# EAGLE design d709-vs1053-synth (EAGLE 7.6.0)
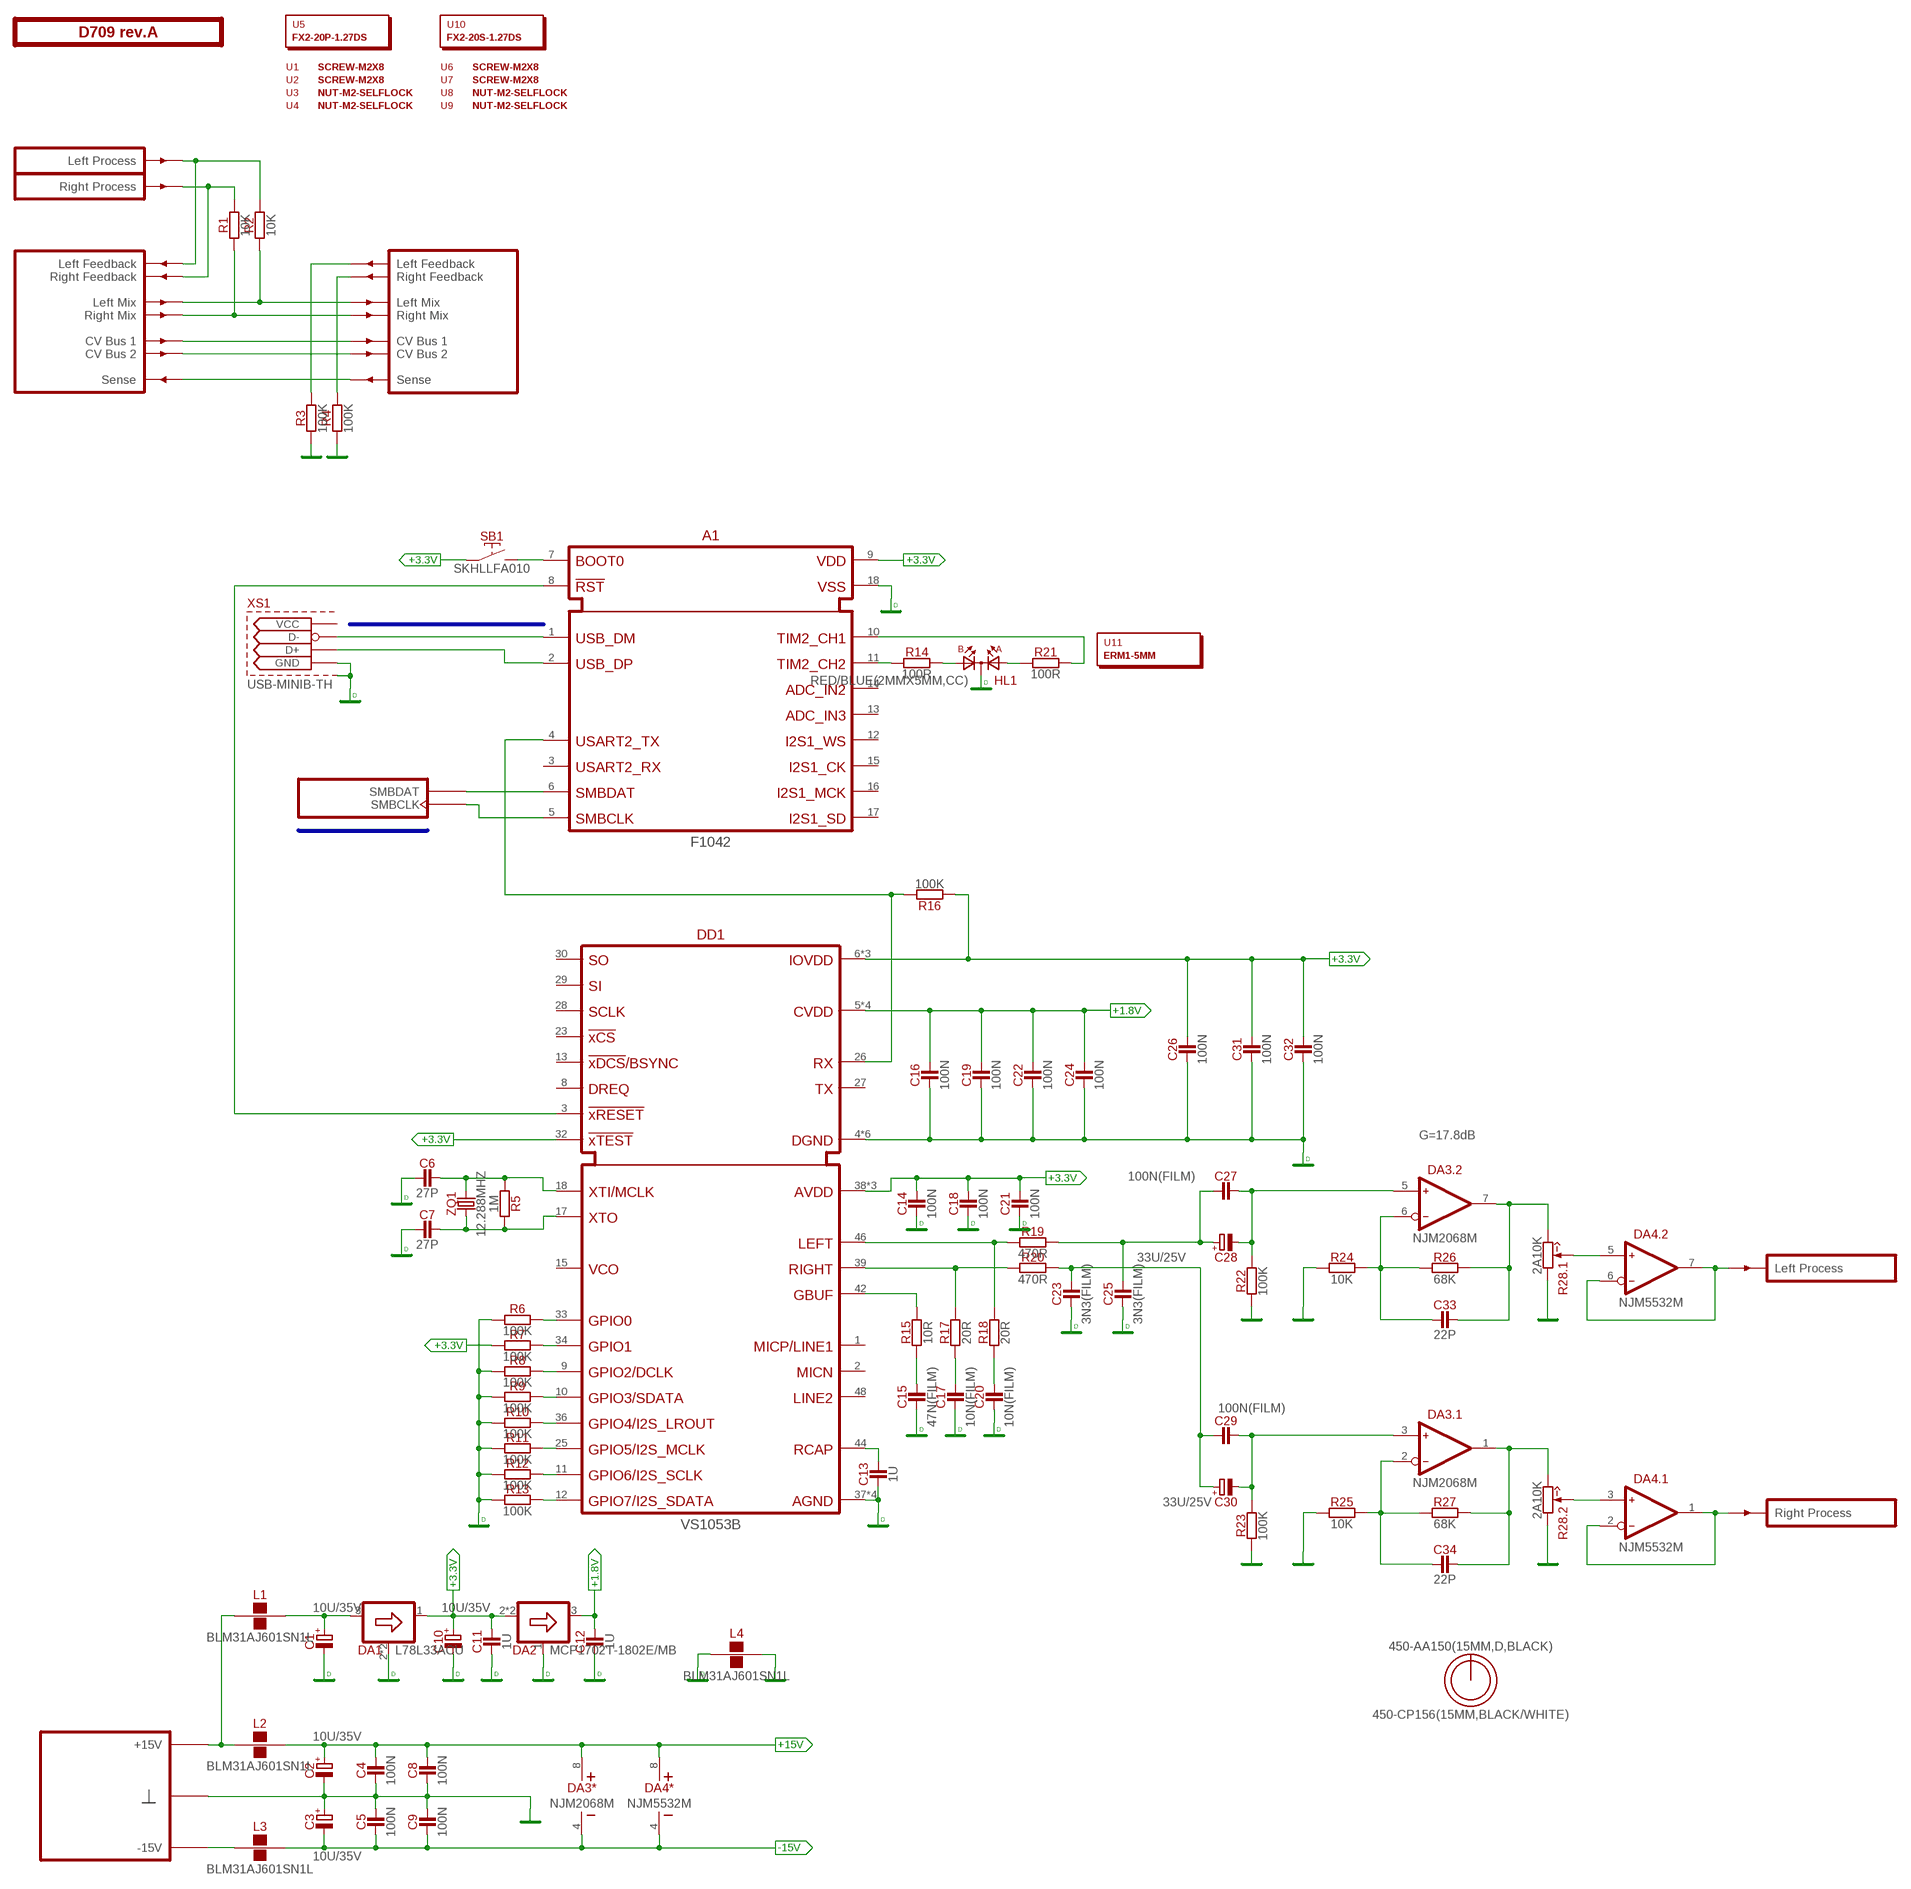
[diagram p0: schematic, sheet 1]

## Parts
A1  F1042  [F-DIP18]
C1  10U/35V  [E2-5]
C2  10U/35V  [E2-5]
C3  10U/35V  [E2-5]
C4  100N  [C-0805]
C5  100N  [C-0805]
C6  27P  [C-0805]
C7  27P  [C-0805]
C8  100N  [C-0805]
C9  100N  [C-0805]
C10  10U/35V  [E2-5]
C11  1U  [C-0805]
C12  1U  [C-0805]
C13  1U  [C-0805]
C14  100N  [C-0805]
C15  47N(FILM)  [C050-025X075]
C16  100N  [C-0805]
C17  10N(FILM)  [C050-025X075]
C18  100N  [C-0805]
C19  100N  [C-0805]
C20  10N(FILM)  [C050-025X075]
C21  100N  [C-0805]
C22  100N  [C-0805]
C23  3N3(FILM)  [C050-025X075]
C24  100N  [C-0805]
C25  3N3(FILM)  [C050-025X075]
C26  100N  [C-0805]
C27  100N(FILM)  [C050-025X075]
C28  33U/25V  [E2,5-7]
C29  100N(FILM)  [C050-025X075]
C30  33U/25V  [E2,5-7]
C31  100N  [C-0805]
C32  100N  [C-0805]
C33  22P  [C-0805]
C34  22P  [C-0805]
DA1  L78L33ACU  [SOT89]
DA2  MCP1702T-1802E/MB  [SOT89]
DA3  NJM2068M  [SO-8]
DA4  NJM5532M  [SO-8]
DD1  VS1053B  [LQFP48-7X7]
HL1  RED/BLUE(2MMX5MM,CC)  [LED2X5-3PIN]
L1  BLM31AJ601SN1L  [1206]
L2  BLM31AJ601SN1L  [1206]
L3  BLM31AJ601SN1L  [1206]
L4  BLM31AJ601SN1L  [1206]
O1  450-AA150(15MM,D,BLACK)  [EMPTY]
O2  450-CP156(15MM,BLACK/WHITE)  [EMPTY]
PCB1  D709 rev.A  ST2-BOARD-50  [ST2-BOARD-50]
R1  10K  [R-0805]
R2  10K  [R-0805]
R3  100K  [R-0805]
R4  100K  [R-0805]
R5  1M  [R-0805]
R6  100K  [R-0805]
R7  100K  [R-0805]
R8  100K  [R-0805]
R9  100K  [R-0805]
R10  100K  [R-0805]
R11  100K  [R-0805]
R12  100K  [R-0805]
R13  100K  [R-0805]
R14  100R  [R-0805]
R15  10R  [R-0805]
R16  100K  [R-0805]
R17  20R  [R-0805]
R18  20R  [R-0805]
R19  470R  [R-0805]
R20  470R  [R-0805]
R21  100R  [R-0805]
R22  100K  [R-0805]
R23  100K  [R-0805]
R24  10K  [R-0805]
R25  10K  [R-0805]
R26  68K  [R-0805]
R27  68K  [R-0805]
R28  2A10K  [RV11-DUAL]
SB1  SKHLLFA010  [SKHLLFA010]
U1  SCREW-M2X8  [EMPTY]
U2  SCREW-M2X8  [EMPTY]
U3  NUT-M2-SELFLOCK  [EMPTY]
U4  NUT-M2-SELFLOCK  [EMPTY]
U5  FX2-20P-1.27DS  [EMPTY]
U6  SCREW-M2X8  [EMPTY]
U7  SCREW-M2X8  [EMPTY]
U8  NUT-M2-SELFLOCK  [EMPTY]
U9  NUT-M2-SELFLOCK  [EMPTY]
U10  FX2-20S-1.27DS  [EMPTY]
U11  ERM1-5MM  [EMPTY]
XS1  USB-MINIB-TH  [USB-MB-H]
ZQ1  12.288MHZ  [3225]

## Nets
+1.8V: C12.2 C16.2 C19.2 C22.2 C24.2 DA2.3(OUT) DD1.5(CVDD) DD1.7(CVDD) DD1.24(CVDD) DD1.31(CVDD)
+3.3V: A1.9(VDD) C10.+ C11.2 C14.2 C18.2 C21.2 C26.2 C31.2 C32.2 DA1.1(OUT) DA2.2(IN) DA2.2@1(IN) DD1.6(IOVDD) DD1.14(IOVDD) DD1.19(IOVDD) DD1.32(!XTEST) DD1.38(AVDD) DD1.43(AVDD) DD1.45(AVDD) R7.1 R16.1 SB1.1
+15V: C2.+ C4.2 C8.2 DA3.8(*:V+) DA4.8(*:V+) L2.2
-15V: C3.- C5.1 C9.1 DA3.4(*:V-) DA4.4(*:V-) L3.2
DGND: A1.18(VSS) C1.- C6.1 C7.1 C10.- C11.1 C12.1 C13.1 C14.1 C15.1 C16.1 C17.1 C18.1 C19.1 C20.1 C21.1 C22.1 C23.1 C24.1 C25.1 C26.1 C31.1 C32.1 DA1.2(GND) DA1.2@1(GND) DA2.1(GND) DD1.4(DGND) DD1.16(DGND) DD1.20(DGND) DD1.21(DGND) DD1.22(DGND) DD1.35(DGND) DD1.37(AGND) DD1.40(AGND) DD1.41(AGND) DD1.47(AGND) HL1.K L4.1 R6.1 R8.1 R9.1 R10.1 R11.1 R12.1 R13.1 XS1.GND XS1.P$1(S1) XS1.P$2(S1) XS1.P$6(S1) XS1.P$7(S1)
GND: C2.- C3.+ C4.1 C5.2 C8.1 C9.2 L4.2 PCB1.B4'(GND) PCB1.B4(GND) PCB1.B5'(GND) PCB1.B5(GND) PCB1.B6'(GND) PCB1.B6(GND) PCB1.B7'(GND) PCB1.B7(GND) PCB1.B8'(GND) PCB1.B8(GND) R3.1 R4.1 R22.1 R23.1 R24.1 R25.1 R28.1'(.2:CCW) R28.1(.1:CCW)
LMIX: PCB1.ALMIX'(LMIX') PCB1.ALMIX(LMIX) R2.1
N$1 [power]: L1.1 L2.1 PCB1.A+15'(P+15V) PCB1.A+15(P+15V) PCB1.B+15'(P+15V) PCB1.B+15(P+15V)
N$2: PCB1.ARFBK'(RFBK') R4.2
N$3: A1.7(BOOT0) SB1.2
N$4: PCB1.ALFBK'(LFBK') R3.2
N$5 [power]: L3.1 PCB1.A-15'(P-15V) PCB1.A-15(P-15V) PCB1.B-15'(P-15V) PCB1.B-15(P-15V)
N$7: C25.2 C27.1 C28.+ R19.2
N$9: C29.2 C30.- DA3.3(.1:IN+) R23.2
N$10: C27.2 C28.- DA3.5(.2:IN+) R22.2
N$11: C34.2 DA3.1(.1:OUT) R27.2 R28.3'(.2:CW)
N$12: C33.2 DA3.7(.2:OUT) R26.2 R28.3(.1:CW)
N$13: C33.1 DA3.6(.2:IN-) R24.2 R26.1
N$14: C34.1 DA3.2(.1:IN-) R25.2 R27.1
N$16: PCB1.BSENSE'(SENSE') PCB1.BSENSE(SENSE)
N$17: C7.2 DD1.17(XTO) R5.2 ZQ1.1
N$18: DA4.6(.2:IN-) DA4.7(.2:OUT) PCB1.BOUTL'(OUTL)
N$21: DA4.1(.1:OUT) DA4.2(.1:IN-) PCB1.BOUTR'(OUTR)
N$23: DA4.5(.2:IN+) R28.2(.1:W)
N$25: DA4.3(.1:IN+) R28.2'(.2:W)
N$29: C1.+ DA1.3(IN) L1.2
N$31: C6.2 DD1.18(XTI/MCLK) R5.1 ZQ1.3
N$36: C23.2 C29.1 C30.+ R20.2
N$39: PCB1.ARFBK(RFBK) PCB1.BINR(INR) R1.2
N$40: PCB1.ALFBK(LFBK) PCB1.BINL(INL) R2.2
N$41: PCB1.ACV1'(CV1') PCB1.ACV1(CV1)
N$42: PCB1.ACV2'(CV2') PCB1.ACV2(CV2)
N$44: A1.8(!RST) DD1.3(!XRESET)
N$45: DD1.12(GPIO7/I2S_SDATA) R13.2
N$46: DD1.11(GPIO6/I2S_SCLK) R12.2
N$47: DD1.25(GPIO5/I2S_MCLK) R11.2
N$48: A1.4(USART2_TX) DD1.26(RX) R16.2
N$49: DD1.36(GPIO4/I2S_LROUT) R10.2
N$50: DD1.10(GPIO3/SDATA) R9.2
N$51: DD1.9(GPIO2/DCLK) R8.2
N$52: DD1.34(GPIO1) R7.2
N$53: DD1.33(GPIO0) R6.2
N$54: C13.2 DD1.44(RCAP)
N$55: A1.11(TIM2_CH2) R14.1
N$56: C15.2 R15.1
N$57: HL1.A2 R14.2
N$58: DD1.42(GBUF) R15.2
N$59: DD1.39(RIGHT) R17.2 R20.1
N$60: C17.2 R17.1
N$61: DD1.46(LEFT) R18.2 R19.1
N$62: C20.2 R18.1
N$65: HL1.A1 R21.1
N$66: A1.10(TIM2_CH1) R21.2
RMIX: PCB1.ARMIX'(RMIX') PCB1.ARMIX(RMIX) R1.1
SMBCLK: A1.5(SMBCLK) PCB1.ASMBCLK'(SMBCLK) PCB1.ASMBCLK(SMBCLK)
SMBDAT: A1.6(SBMDAT) PCB1.ASMBDAT'(SMBDAT) PCB1.ASMBDAT(SMBDAT)
USB_N: A1.1(USB_DM) XS1.D-
USB_P: A1.2(USB_DP) XS1.D+
Unconnected: A1.3(USART2_RX) A1.12(I2S1_WS) A1.13(ADC_IN3) A1.14(ADC_IN2) A1.15(I2S1_CK) A1.16(I2S1_MCK) A1.17(I2S1_SD) DD1.1(MICP/LINE1) DD1.2(MICN) DD1.8(DREQ) DD1.13(!XDCS/BSYNC) DD1.15(VCO) DD1.23(!XCS) DD1.27(TX) DD1.28(SCLK) DD1.29(SI) DD1.30(SO) DD1.48(LINE2) XS1.VBUS(VCC)

## Buses
SMBDAT,SMBCLK
USB_N,USB_P

## Notes on the sheet
- G=17.8dB

## Library data of the parts
A1 = module-footprints:F1042
C1-C3 C10 = capacitors-electrolytic:?; MOUSER: 647-USW1V100MDD
C4 C5 C8 C9 C14 C16 C18 C19 C21 C22 C24 C26 C31 C32 = capacitors:?; MOUSER: 77-VJ0805V104MXBPBC
C6 C7 = capacitors:?; MOUSER: 77-VJ0805A270GXACBC
C11-C13 = capacitors:?; MOUSER: 77-VJ0805V105ZXXTBC
C15 = capacitors:?; MOUSER: 871-B32529C1473J
C17 C20 = capacitors:?; MOUSER: 80-F622JF103J100C
C23 C25 = capacitors:?; MOUSER: 505-FKS23300/100/10
C27 C29 = capacitors:?; MOUSER: 505-MKS2.1/63/5
C28 C30 = capacitors-electrolytic:?
C33 C34 = capacitors:?; MOUSER: 77-VJ0805A220GXACBC
DA1 = regulators-linear:?; MOUSER: 511-L78L33ACU
DA2 = regulators-linear:?; MOUSER: 579-MCP1702T1802E/MB
DA3 = ic-jrc:NJM2068; MOUSER: 513-NJM2068M
DA4 = ic-jrc:NJM5532; MOUSER: 513-NJM5532M
DD1 = ic-vlsi:VS1053B
HL1 = optoelectronics:?(2MMX5MM,CC)
L1-L4 = inductors:BLM31AJ601SN1L; MOUSER: 81-BLM31AJ601SN1L
O1 = hardware:450-AA?; MOUSER: 450-AA150
O2 = hardware:450-C?; MOUSER: 450-CP156
PCB1 = module-footprints:ST2-BOARD-?
R1 R2 R24 R25 = resistors:?; MOUSER: 660-RK73H2ATTD1002F
R3 R4 R6-R13 R16 R22 R23 = resistors:?; MOUSER: 660-RK73H2ATTD1003F
R5 = resistors:?; MOUSER: 660-RK73H2ATTD1004F
R14 R21 = resistors:?; MOUSER: 660-RK73H2ATTD1000F
R15 = resistors:?; MOUSER: 660-RK73H2ATTD10R0F
R17 R18 = resistors:?; MOUSER: 660-RK73H2ATTD20R0F
R19 R20 = resistors:?; MOUSER: 660-RK73H2ATTD4700F
R26 R27 = resistors:?; MOUSER: 660-RK73H2ATTD6802F
R28 = potentiometers:2**?; MOUSER: 688-RK12L12C0A0E
SB1 = switches:SKHLLFA010; MOUSER: 688-SKHLLF
U1-U4 U6-U9 = hardware:*?
U5 = hardware:?; MOUSER: 798-FX2-20P-1.27DS71
U10 = hardware:?; MOUSER: 798-FX2-20S-1.27DS71
U11 = hardware:?
XS1 = connectors:USB-MINIB-TH
ZQ1 = frequency:?; MOUSER: 581-CX3225GB1228PHPC

## Board
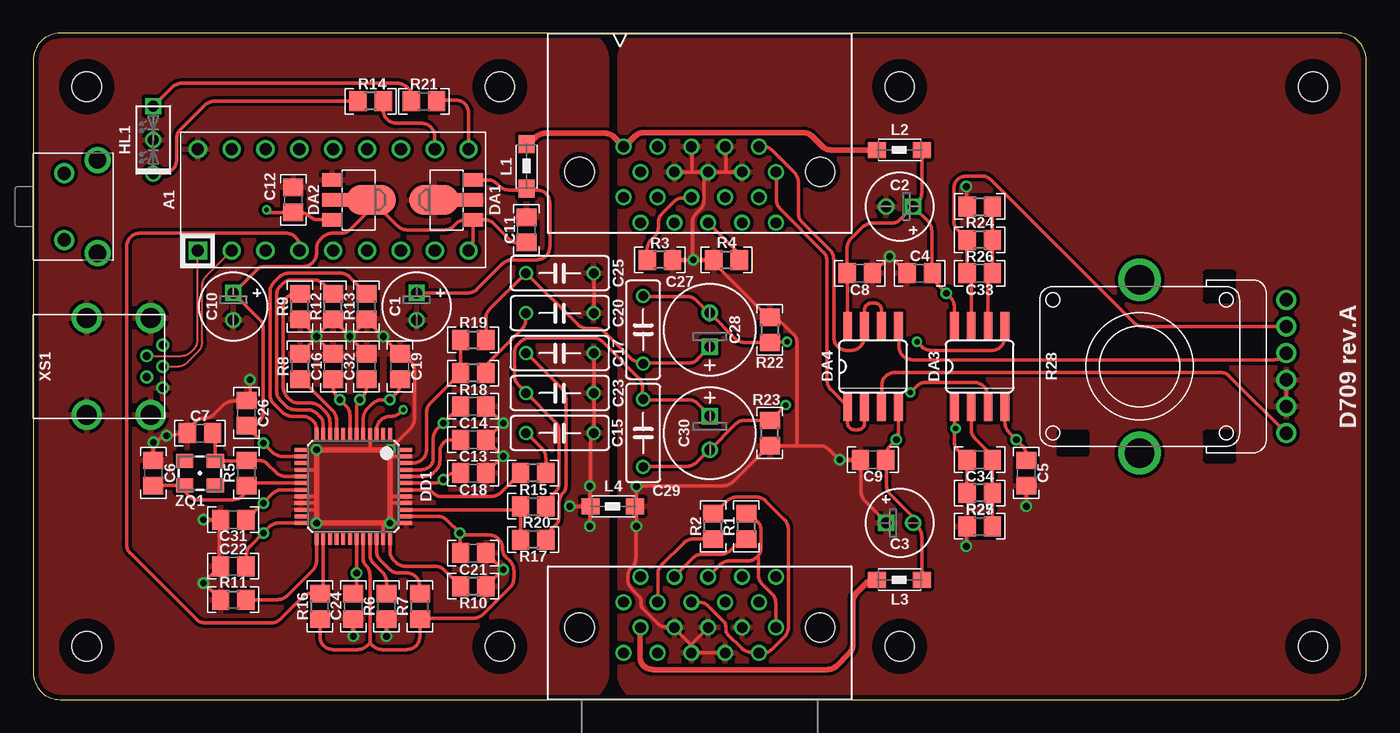
[diagram p1: board, top side]
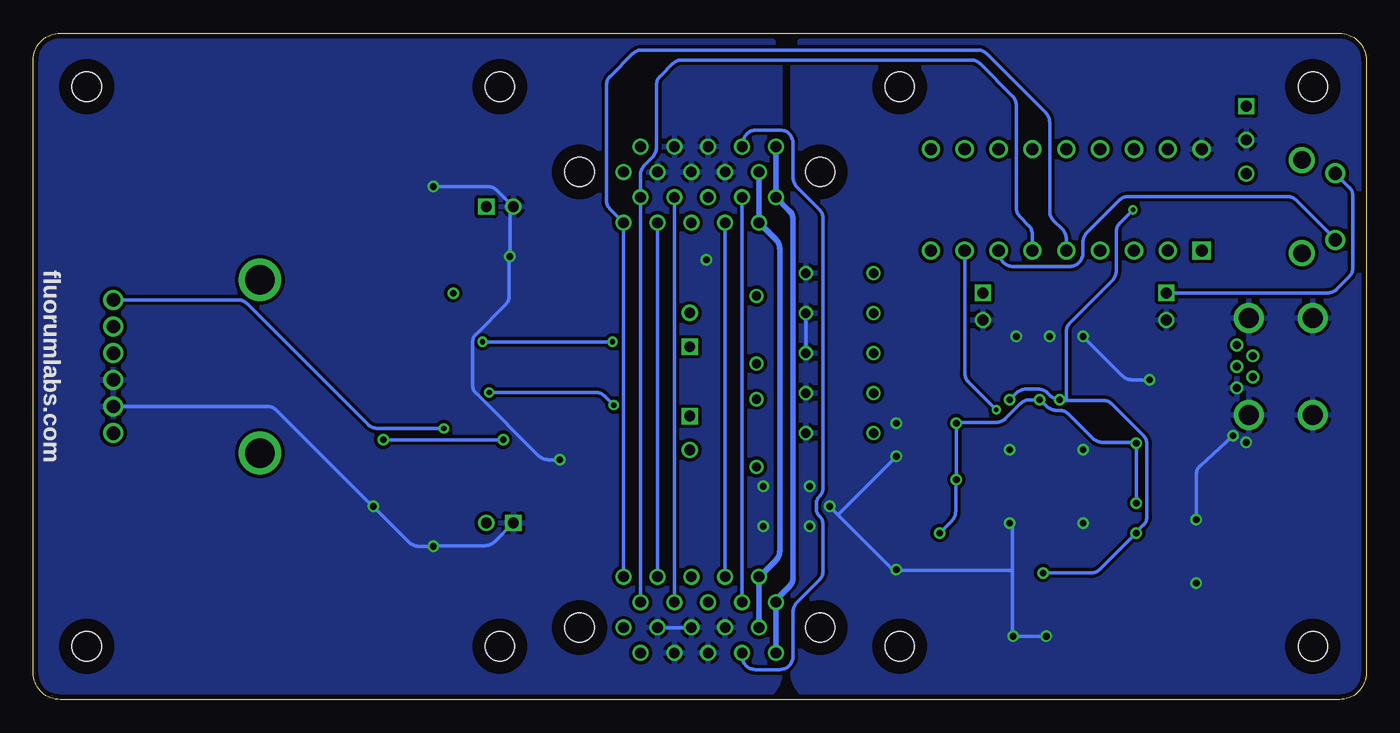
[diagram p2: board, bottom side, seen from below]

Size 100 x 50 mm. Coordinates in mm from the lower left corner, seen from the top.
Outline: 0,48 0,2 arc90 2,0 98,0 arc90 100,2 100,48 arc90 98,50 2,50 arc90 0,48
Copper layers (1*16): Top 0.0356mm / dielectric 1.5011mm / Bottom 0.0356mm
Design rules "sonictrain": minimum track width 6mil, minimum drill 13mil, track to track 8mil, track to pad 8mil, pad to pad 6mil, via to via 6mil, smd to smd 6mil, copper to edge 15mil, drill to drill 6mil, minimum pad ring 7mil, minimum via ring 7mil, stop-mask expansion 3mil, vias tented up to drill 25mil, thermal gap 10mil

### Footprints (pad centres in the part's own frame; a part is rotated, then mirrored left to right if it is on the bottom)
F-DIP18 = drill 0.914 square: 1 -10.16,-3.81 | drill 0.914: 2 -7.62,-3.81; 3 -5.08,-3.81; 4 -2.54,-3.81; 5 0,-3.81; 6 2.54,-3.81; 7 5.08,-3.81; 8 7.62,-3.81; 9 10.16,-3.81; 10 10.16,3.81; 11 7.62,3.81; 12 5.08,3.81; 13 2.54,3.81; 14 0,3.81; 15 -2.54,3.81; 16 -5.08,3.81; 17 -7.62,3.81; 18 -10.16,3.81
E2-5 = drill 0.813 square: + -1.016,0 | drill 0.813: - 1.016,0
C-0805 = smd 1.3 x 1.5: 1 -0.95,0; 2 0.95,0
C050-025X075 = drill 0.7: 1 -2.54,0; 2 2.54,0
E2,5-7 = drill 0.813 square: + -1.27,0 | drill 0.813: - 1.27,0
SOT89 = smd 1 x 1.5: 1 -1.499,-1.981; 3 1.499,-1.981 | smd 1 x 2: 2 0,-1.727 | smd 2.2 x 3.7: 2@1 0,0.94
SO-8 = smd 0.66 x 2.032: 1 -1.905,-3.073; 2 -0.635,-3.073; 3 0.635,-3.073; 4 1.905,-3.073; 5 1.905,3.073; 6 0.635,3.073; 7 -0.635,3.073; 8 -1.905,3.073
LQFP48-7X7 = smd 0.9 x 0.3: 1 -3.95,2.75; 2 -3.95,2.25; 3 -3.95,1.75; 4 -3.95,1.25; 5 -3.95,0.75; 6 -3.95,0.25; 7 -3.95,-0.25; 8 -3.95,-0.75; 9 -3.95,-1.25; 10 -3.95,-1.75; 11 -3.95,-2.25; 12 -3.95,-2.75; 25 3.95,-2.75; 26 3.95,-2.25; 27 3.95,-1.75; 28 3.95,-1.25; 29 3.95,-0.75; 30 3.95,-0.25; 31 3.95,0.25; 32 3.95,0.75; 33 3.95,1.25; 34 3.95,1.75; 35 3.95,2.25; 36 3.95,2.75 | smd 0.3 x 0.9: 13 -2.75,-3.95; 14 -2.25,-3.95; 15 -1.75,-3.95; 16 -1.25,-3.95; 17 -0.75,-3.95; 18 -0.25,-3.95; 19 0.25,-3.95; 20 0.75,-3.95; 21 1.25,-3.95; 22 1.75,-3.95; 23 2.25,-3.95; 24 2.75,-3.95; 37 2.75,3.95; 38 2.25,3.95; 39 1.75,3.95; 40 1.25,3.95; 41 0.75,3.95; 42 0.25,3.95; 43 -0.25,3.95; 44 -0.75,3.95; 45 -1.25,3.95; 46 -1.75,3.95; 47 -2.25,3.95; 48 -2.75,3.95
LED2X5-3PIN = drill 0.813 square: A1 -2.54,0 | drill 0.813: A2 2.54,0; K 0,0
1206 = smd 1.35 x 1.2: 1 -1.7,0; 2 1.65,0
ST2-BOARD-50 = drill 0.8: A+15 44.285,7.31; A+15' 44.285,37.69; A-15 45.555,9.215; A-15' 45.555,35.785; ACV1 51.905,7.31; ACV1' 51.905,37.69; ACV2 53.175,9.215; ACV2' 53.175,35.785; ALFBK 49.365,7.31; ALFBK' 49.365,37.69; ALMIX 46.825,7.31; ALMIX' 46.825,37.69; ARFBK 50.635,9.215; ARFBK' 50.635,35.785; ARMIX 48.095,9.215; ARMIX' 48.095,35.785; ASMBCLK 55.715,9.215; ASMBCLK' 55.715,35.785; ASMBDAT 54.445,7.31; ASMBDAT' 54.445,37.69; B4 48.095,5.405; B4' 48.095,39.595; B5 49.365,3.5; B5' 49.365,41.5; B6 50.635,5.405; B6' 50.635,39.595; B7 51.905,3.5; B7' 51.905,41.5; B8 53.175,5.405; B8' 53.175,39.595; B+15 44.285,3.5; B+15' 44.285,41.5; B-15 45.555,5.405; B-15' 45.555,39.595; BINL 54.445,3.5; BINR 55.715,5.405; BOUTL' 54.445,41.5; BOUTR' 55.715,39.595; BSENSE 46.825,3.5; BSENSE' 46.825,41.5 | hole 2.2: 4,4; 4,46; 96,4; 96,46; 35,46; 65,46; 65,4; 35,4; 59.025,5.405; 40.975,5.405; 40.975,39.595; 59.025,39.595
R-0805 = smd 1.3 x 1.5: 1 -0.95,0; 2 0.95,0
RV11-DUAL = drill 1: 1 -1,-11; 1' -3,-11; 2 1,-11; 2' -5,-11; 3 3,-11; 3' 5,-11 | drill 2.2: S1 -6.5,0; S2 6.5,0
SKHLLFA010 = drill 1: 1 -2.5,2.32; 2 2.5,2.32 | drill 1.3: S1 -3.5,4.82; S2 3.5,4.82
USB-MB-H = drill 0.6: D+ 9.7,0; D- 8.5,0.8; GND 9.7,-1.6; ID 8.5,-0.8; VBUS 9.7,1.6 | drill 1.5: P$1 8.8,3.65; P$2 8.8,-3.65; P$6 4,-3.65; P$7 4,3.65
3225 = smd 1.3 x 1.05: 1 -1.15,-0.925; 2 1.15,-0.925; 3 1.15,0.925; 4 -1.15,0.925

### Placement (x,y rotation side)
A1  22.5,37.5 0 top
C1  28.75,29.5 270 top
C2  65,37 180 top
C3  65,13.25 0 top
C4  66.5,32 0 top
C5  74.5,17 270 top
C6  9,17 270 top
C7  12.5,20 0 top
C8  62,32 180 top
C9  63,18 180 top
C10  15,29.5 270 top
C11  37,35.25 270 top
C12  19.5,37.5 270 top
C13  33,19.5 180 top
C14  33,22 180 top
C15  39.5,20 180 top
C16  22.5,25 270 top
C17  39.5,26 180 top
C18  33,17 180 top
C19  27.5,25 270 top
C20  39.5,29 180 top
C21  33,11 180 top
C22  15,10 0 top
C23  39.5,23 180 top
C24  24,7 90 top
C25  39.5,32 180 top
C26  16,21.5 270 top
C27  45.75,27.75 90 top
C28  50.75,27.75 90 top
C29  45.75,20 270 top
C30  50.75,20 270 top
C31  15,13.5 0 top
C32  25,25 270 top
C33  71,32 180 top
C34  71,18 180 top
DA1  31,37.5 90 top
DA2  24.4,37.5 270 top
DA3  71,25 0 top
DA4  63,25 0 top
DD1  24,16 270 top
HL1  9,42 270 top
L1  37,40 270 top
L2  65,41.25 0 top
L3  65,9 0 top
L4  43.5,14.5 0 top
O1  84,-100 0 top  (outside the outline)
O2  87,-100 0 top  (outside the outline)
PCB1  0,0 0 top
R1  53.5,13 90 top
R2  51,13 90 top
R3  47,33 180 top
R4  52,33 0 top
R5  16,17 90 top
R6  26.5,7 90 top
R7  29,7 90 top
R8  20,25 270 top
R9  20,29.5 90 top
R10  33,8.5 180 top
R11  15,7.5 0 top
R12  22.5,29.5 90 top
R13  25,29.5 90 top
R14  25.3,44.9 180 top
R15  37.5,17 180 top
R16  21.5,7 90 top
R17  37.5,12 180 top
R18  33,24.5 180 top
R19  33,27 0 top
R20  37.5,14.5 0 top
R21  29.3,44.9 0 top
R22  55.25,27.75 270 top
R23  55.25,20 90 top
R24  71,37 0 top
R25  71,13 0 top
R26  71,34.5 180 top
R27  71,15.5 180 top
R28  2*A10K  [RV11-DUAL]  83,25 90 top
SB1  0,37 270 top
U1  -8,-104.25 0 top  (outside the outline)
U2  -9,-105.5 0 top  (outside the outline)
U3  -12,-109.25 0 top  (outside the outline)
U4  -13,-110.5 0 top  (outside the outline)
U5  96,-100 0 top  (outside the outline)
U6  -10,-106.75 0 top  (outside the outline)
U7  -11,-108 0 top  (outside the outline)
U8  -14,-111.75 0 top  (outside the outline)
U9  -15,-113 0 top  (outside the outline)
U10  2,-103 0 top  (outside the outline)
U11  5,-103 0 top  (outside the outline)
XS1  0,25 0 top
ZQ1  12.5,17 180 top

### Tracks (layer width: path | path; a pad name or v marks a point on that pad's centre or on a via)
+1.8V  (via drill 0.33, 0.5)
  Top 0.254: C22.2 16,10.05 16,10.84 arc-45 16.29,11.54 v17.25,12.5 17.71,12.96 arc-45 18.41,13.25 DD1.24 | C24.2 24.25,8.2 v24.25,9.5 DD1.31 | DD1.7 23.75,21.34 arc45 23.46,22.04 v23,22.5 22.79,22.71 arc-45 22.5,23.41 C16.2 | DD1.5 24.75,21.09 arc-45 25.04,21.79 25.46,22.21 arc-45 26.16,22.5 v26.75,22.5 27.21,22.96 arc45 27.5,23.66 C19.2 | v17.5,36.75 17.7,36.55 C12.2 19.55,36.5 20.21,36.5 arc-45 20.71,36.29 arc45 21.41,36 DA2.3
  Bottom 0.254: v26.75,22.5 26.24,23.01 arc45 25.54,23.3 24.61,23.3 arc45 23.91,23.01 23.68,22.78 arc-45 v23,22.5 22.9,22.45 22.5,22.45 | v24.25,9.5 20.66,9.5 arc-45 19.96,9.79 v17.25,12.5 17.2,12.6 16.74,13.06 arc-45 16.45,13.76 16.45,19.14 arc-45 16.74,19.84 19.06,22.16 arc-45 19.76,22.45 22.5,22.45 | v17.5,36.75 18.46,35.79 arc-45 18.75,35.09 18.75,32.16 arc45 19.04,31.46 22.21,28.29 arc-45 22.5,27.59 22.5,22.45
+3.3V  (via drill 0.5)
  Top 0.254: DD1.38 30.34,13.75 arc-45 31.04,13.46 v32,12.5 | v32,12.5 32,11.05 C21.2 | DD1.45 29.09,17.25 arc45 29.79,17.54 arc45 30,18.04 30,19.59 arc-45 30.29,20.29 v30.75,20.75 32,22 C14.2 | DD1.32 24.75,10.54 arc45 24.96,10.04 arc-45 25.25,9.34 25.25,4.25 | 25.25,4.25 25.04,4.04 arc-45 24.34,3.75 22.5,3.75 arc-90 21.5,4.75 R16.1 | DD1.6 24.25,21.9 arc-45 v24.5,22.5 24.71,22.71 arc45 25,23.41 C32.2 | DD1.43 30.15,16.25 arc45 v30.75,16.5 30.96,16.71 arc-45 31.66,17 C18.2 | DD1.14 18.66,18.25 arc-45 17.96,18.54 v17.25,19.25 16,20.5 C26.2 16.25,20.55 arc90 17.25,21.55 17.25,27.85 arc45 16.96,28.56 C10.+ 15.02,30.52 16.71,32.21 arc-45 17.41,32.5 20.25,32.5 arc90 21.25,33.5 21.25,33.84 arc-45 21.54,34.54 21.71,34.71 arc-45 22.41,35 23.09,35 arc45 23.79,35.29 25.7,37.2 | DD1.19 18.66,15.75 arc45 17.96,15.46 v17.25,14.75 16,13.5 C31.2 | 25.25,4.25 25.46,4.04 arc45 26.16,3.75 28,3.75 arc90 29,4.75 R7.1 29.1,6.1 33.04,6.1 arc45 33.74,6.39 35.76,8.41 arc45 36.05,9.11 36.05,9.69 arc45 35.76,10.39 35.48,10.67 arc-45 35.2,11.35 arc90 34.2,12.35 32.1,12.35 v32,12.5 | DA1.1 33.84,36 arc-45 34.54,35.71 35.71,34.54 arc45 36.41,34.25 36.95,34.25 C11.2 | DA1.1 32.98,34.42 arc-45 32.69,33.72 A1.9 | DA2.2 DA2.2@1 25.7,37.2 | DA1.1 32.41,36 arc45 31.71,35.71 31.54,35.54 arc-45 30.84,35.25 28.05,35.25 arc-45 27.35,35.54 25.7,37.2
  Bottom 0.254: v17.25,14.75 v17.25,19.25 17.35,19.3 19.79,19.3 arc45 20.49,19.59 22.31,21.41 arc-45 23.01,21.7 23.24,21.7 arc45 23.94,21.99 24.4,22.45 v24.5,22.5 25.24,22.5 arc-45 25.94,22.21 27.06,21.09 arc45 27.76,20.8 30.65,20.8 v30.75,20.75 v30.75,16.5 30.8,16.4 30.8,14.11 arc45 31.09,13.41 v32,12.5 | C10.+ 2.9,30.52 arc-45 2.19,30.81 1.29,31.71 arc-45 1,32.41 1,37.77 arc-45 1.29,38.47 SB1.1
+15V  (via drill 0.5)
  Top 0.254: DA3.8 69.09,29.49 arc45 68.8,30.2 v68.5,30.5 67.45,31.55 C4.2 67.4,32.1 67.4,35.19 arc45 67.11,35.89 66.1,36.9 C2.+ | L2.2 66.65,38.01 arc-45 66.36,37.31 66.05,37 C2.+ | DA4.8 61.09,31.95 C8.2 61.05,33.89 arc-45 61.34,34.59 62.21,35.46 arc-45 62.91,35.75 64.35,35.75 arc45 65.06,36.04 C2.+
-15V  (via drill 0.5)
  Top 0.254: DA4.4 64.91,19.87 arc-45 v64.75,19.5 64.24,18.99 arc45 63.95,18.29 C9.1 64,17.9 64,16.11 arc45 64.29,15.41 65.95,13.75 65.95,13.35 C3.- 66.05,13.25 66.36,12.94 arc-45 66.65,12.24 L3.2 | DA3.4 72.91,20.76 arc45 73.2,20.05 v73.75,19.5 74.21,19.04 arc-45 74.5,18.34 C5.1
  Bottom 0.254: v64.75,19.5 v73.75,19.5
DGND  (via drill 0.5)
  Top 0.254: DD1.35 26.25,13.25 | DD1.37 v26.75,13.25 | DD1.41 26.75,15.25 | DD1.40 26.75,14.75 | DD1.47 26.75,18.25 | DD1.4 25.25,18.75 | DD1.16 21.25,17.25 | DD1.20 21.25,15.25 | DD1.21 21.25,14.75 | DD1.22 21.25,14.25 | C24.1 v24,4.75 | R6.1 v26.5,4.75 | C18.1 35.15,18.2 v35.25,18.25 34,19.5 C13.1 34.05,19.55 v35.25,20.75 35.15,20.8 C14.1 | C20.1 C25.1 | C21.1 34,11 v35.25,9.75 35.15,9.7 R10.1 | L4.1 v40.25,14.5 | v41.75,13 41.75,14.4 L4.1 | L4.1 41.75,14.6 v41.75,16 41.8,16.1 41.8,19.52 arc-45 42,20 C15.1 42.05,20.1 C23.1 42.05,23.1 C17.1 | v12.75,13.5 C31.1 13.95,13.4 13.95,10.1 C22.1 14,10 v12.75,8.75 12.85,8.7 R11.1 | v16.25,24 16.25,22.7 C26.1 15.9,22.4 14.96,22.4 arc45 14.26,22.11 13.54,21.39 arc-45 12.84,21.1 12.81,21.1 arc45 12.11,20.81 11.6,20.3 11.6,20.1 C7.1 v10,19.8 9.79,19.79 arc-45 9.09,19.5 v9,19.3 C6.1 | v21.25,27.25 20,28.5 R9.1 | R8.1 21.2,27.15 v21.25,27.25 | C16.1 21.3,27.15 v21.25,27.25 | v23.75,27.25 22.5,28.5 R12.1 21.3,27.35 v21.25,27.25 | C32.1 23.8,27.15 v23.75,27.25 | v23.75,27.25 23.85,27.3 24.95,28.4 R13.1 25,28.5 v26.25,27.25 26.3,27.15 C19.1 27.6,25.9 27.8,25.9 28.31,25.39 arc-45 28.6,24.69 28.6,21.06 arc-45 28.31,20.36 26.85,18.9 v26.75,18.75
  Top 0.406: v21.25,13.25 21.25,14.25 21.25,14.75 21.25,15.25 21.25,17.25 v21.25,18.75 25.25,18.75 v26.75,18.75 26.75,18.25 26.75,15.25 26.75,14.75 v26.75,13.25 26.25,13.25 v21.25,13.25
  Bottom 0.254: v24,4.75 v26.5,4.75 26.55,4.85 26.55,9.7 | 26.55,9.7 26.55,13.05 v26.75,13.25 | v40.25,14.5 39.62,13.88 | 39.62,13.88 35.5,9.75 v35.25,9.75 35.15,9.7 26.55,9.7 | C20.1 C17.1 | 39.62,13.88 v35.25,18.25 | v10,19.8 12.46,17.54 arc-45 12.75,16.84 v12.75,13.5 | v21.25,27.25 18.29,24.29 arc-45 17.59,24 v16.25,24
  pour Bottom (isolate 0.254, rank 2): 43,48 43,2 arc-90 41,0 2,0 arc-90 0,2 0,48 arc-90 2,50 41,50 arc-90
  pour Top (isolate 0.254, rank 2): 43,48 43,2 arc-90 41,0 2,0 arc-90 0,2 0,48 arc-90 2,50 41,50 arc-90
GND  (via drill 0.5)
  Top 0.254: R28.1 R28.1' | v70,11.5 70,12.95 R25.1 | C5.2 v74.5,14.5 | 49.4,39.6 50.6,39.6 PCB1.B6' | 49.4,39.6 PCB1.B4' | 51.95,39.6 50.75,39.6 PCB1.B6' | 51.95,39.6 53.15,39.6 PCB1.B8' | 49.4,39.6 49.4,41.5 PCB1.B5' | 51.95,39.6 51.95,41.5 PCB1.B7' | R3.1 v49.5,33 | v49.5,33 R4.1 51.05,32.75 55.1,28.7 R22.1 55.35,28.65 55.8,28.65 57.01,27.44 arc-45 57.3,26.74 57.3,19.05 | PCB1.B6' 50.3,39.5 50.3,37.46 arc-45 50.01,36.76 49.74,36.49 arc45 49.45,35.79 49.45,33.1 v49.5,33 | 49.35,4.1 49.35,3.5 PCB1.B5 PCB1.B7 | 49.35,4.1 48.15,5.3 PCB1.B4 48.05,5.45 47.51,5.45 arc-45 46.81,5.74 45.75,6.8 arc-45 45.6,7.16 45.6,7.39 arc45 45.45,7.75 44.89,8.31 arc-45 44.6,9.01 44.6,9.19 arc-45 44.89,9.89 44.91,9.91 arc45 45.2,10.61 45.2,12.9 v45.25,13 45.25,14.4 L4.2 45.25,14.55 v45.25,16 45.35,16.05 51.79,16.05 arc45 52.49,16.34 55.15,19 R23.1 57.3,19.05 | PCB1.B6 50.6,5.4 49.4,4.2 49.35,4.1 | C8.1 63,32 v64.25,33.25 64.35,33.2 C4.1 | v70,38.5 70,37.05 R24.1 | 57.3,19.05 58.99,19.05 arc-45 59.69,18.76 60.4,18.05 v60.5,18 C9.2 62.1,17.9 62.1,15.61 arc45 62.39,14.91 63.95,13.35 63.95,13.25 C3.+
  Bottom 0.254: R28.1' 82.46,22 arc45 81.76,21.71 74.6,14.55 v74.5,14.5 71.79,11.79 arc-45 71.09,11.5 v70,11.5 69.9,11.55 66.11,11.55 arc-45 65.41,11.84 64,13.25 C3.+ | PCB1.B8 53.15,5.4 50.65,5.4 PCB1.B6 | v70,38.5 65.91,38.5 arc45 65.21,38.21 64,37 C2.- 64.05,36.9 64.25,36.7 v64.25,33.25 64.3,33.15 64.3,30.31 arc45 64.59,29.61 66.76,27.44 arc-45 67.05,26.74 67.05,23.66 arc-45 66.76,22.96 62.09,18.29 arc-45 61.39,18 v60.5,18
  pour Bottom (isolate 0.254): 98,0 46,0 arc-90 44,2 44,48 arc-90 46,50 98,50 arc-90 100,48 100,2 arc-90
  pour Top (isolate 0.254): 98,0 46,0 arc-90 44,2 44,48 arc-90 46,50 98,50 arc-90 100,48 100,2 arc-90
LMIX
  Top 0.254: R2.1 49.51,12.05 arc45 48.81,11.76 47.14,10.09 arc45 46.85,9.39 46.85,7.35 PCB1.ALMIX
  Bottom 0.254: PCB1.ALMIX' PCB1.ALMIX
N$1
  Top 0.406: L2.1 59.86,41.25 arc-45 59.16,41.54 58.44,42.26 arc45 57.74,42.55 45.81,42.55 arc45 45.11,42.26 44.45,41.6 PCB1.B+15' 43.58,42.21 arc45 42.87,42.5 38.41,42.5 arc45 37.71,42.21 37.2,41.7 L1.1
  Bottom 0.406: PCB1.B+15 PCB1.A+15 44.28,7.46 43.29,8.46 arc-45 43,9.16 43,35.99 arc-45 43.29,36.7 PCB1.A+15' PCB1.B+15'
N$2
  Top 0.254: R4.2 52.95,33.45 50.65,35.75 PCB1.ARFBK'
N$3
  Bottom 0.254: SB1.2 2.32,34.57 5.21,37.46 arc-45 5.91,37.75 17.84,37.75 arc-45 18.54,37.46 20.96,35.04 arc-45 21.25,34.34 21.25,33.5 arc90 22.25,32.5 26.5,32.5 arc90 27.5,33.5 27.5,33.61 A1.7
N$4
  Top 0.254: R3.2 46.05,33.79 arc-45 46.34,34.49 46.61,34.76 arc45 46.9,35.46 46.9,35.79 arc-45 47.19,36.49 48.06,37.36 arc-45 48.76,37.65 49.35,37.65 PCB1.ALFBK'
N$5
  Top 0.406: L3.1 63.16,9 arc45 62.46,8.71 61.79,8.04 arc45 61.5,7.34 61.5,4.16 arc-45 61.21,3.46 60.29,2.54 arc-45 59.59,2.25 46.5,2.25 arc-90 45.5,3.25 45.5,5.35 PCB1.B-15
  Bottom 0.406: PCB1.B-15 PCB1.A-15 45.53,9.21 44.29,10.46 arc-45 44,11.16 44,33.82 arc-45 44.29,34.52 PCB1.A-15' PCB1.B-15'
N$7
  Top 0.254: C28.+ 50.75,26.45 49.84,25.54 arc-45 49.14,25.25 45.75,25.25 C27.1 45.65,25.3 45.56,25.3 arc-45 44.86,25.59 42.89,27.56 arc45 42.19,27.85 41.56,27.85 arc-45 40.86,28.14 37.05,31.95 C25.2 34.24,29.29 arc45 33.95,28.59 R19.2
N$9  (via drill 0.4)
  Top 0.254: v65.8,23.05 66.26,23.51 arc-45 66.96,23.8 70.6,23.8 arc-90 71.6,22.8 71.6,21.95 DA3.3 | v56.45,22.1 55.35,21 R23.2 53.36,20.95 arc45 52.66,20.66 50.75,18.75 C30.- 50.65,18.7 49.74,17.79 arc-45 49.04,17.5 45.75,17.5 C29.2
  Bottom 0.254: v56.45,22.1 57.11,22.76 arc-45 57.81,23.05 v65.8,23.05
N$10  (via drill 0.4)
  Top 0.254: v66.3,26.85 66.66,26.49 arc45 67.36,26.2 71.9,26.2 arc90 72.9,27.2 72.9,28.05 DA3.5 | v56.55,26.85 55.35,26.85 R22.2 53.36,26.8 arc-45 52.66,27.09 50.75,29 C28.- 50.65,29.05 49.74,29.96 arc45 49.04,30.25 45.75,30.25 C27.2
  Bottom 0.254: v56.55,26.85 v66.3,26.85
N$11  (via drill 0.4)
  Top 0.254: R27.2 C34.2 69.39,18.66 arc-45 69.09,19.37 69.09,20.35 | DA3.1 69.09,20.35 | v69.2,20.35 69.09,20.35
  Bottom 0.254: R28.3' 84.66,30 arc45 83.96,29.71 74.89,20.64 arc-45 74.19,20.35 v69.2,20.35
N$12
  Top 0.254: DA3.7 70.36,31.68 C33.2 R26.2 70,34.6 69.34,35.26 arc-45 69.05,35.96 69.05,38.3 arc-90 70.05,39.3 71.14,39.3 arc-45 71.84,39.01 82.56,28.29 arc45 83.26,28 R28.3
N$13
  Top 0.254: DA3.6 71.64,31.68 C33.1 R26.1 R24.2
N$14
  Top 0.254: DA3.2 70.36,20.3 arc45 70.66,19.59 71.95,18.3 C34.1 R27.1 R25.2
N$16
  Bottom 0.254: PCB1.BSENSE 46.83,3.25 arc-90 45.83,2.25 44,2.25 arc-90 43,3.25 43,6.59 arc45 42.71,7.29 41.04,8.96 arc-45 40.75,9.66 40.75,13.09 arc-45 41.04,13.79 arc45 41.25,14.29 41.25,14.71 arc45 41.04,15.21 arc-45 40.75,15.91 40.75,36.09 arc-45 41.04,36.79 42.71,38.46 arc45 43,39.16 43,41.75 arc-90 44,42.75 45.75,42.75 arc-90 46.75,41.75 46.75,41.58 PCB1.BSENSE'
N$17
  Top 0.254: DD1.17 18.91,16.75 arc-45 18.21,17.04 17.59,17.66 arc45 16.89,17.95 R5.2 15.97,17.93 ZQ1.1 13.65,19.8 C7.2
N$18
  Top 0.254: DA4.6 63.63,29.25 arc90 63.13,29.75 62.87,29.75 arc90 62.37,29.25 DA4.7 62.35,27.95 62.35,27.2 arc-90 61.35,26.2 61.05,26.2 arc-90 60.05,27.2 60.05,33.04 arc45 59.76,33.74 57.69,35.81 arc-45 57.4,36.51 57.4,38.84 arc45 57.11,39.54 55.44,41.21 arc45 54.74,41.5 PCB1.BOUTL'
N$21
  Top 0.254: DA4.2 62.37,20.75 arc-90 61.87,20.25 61.59,20.25 arc-90 61.09,20.75 DA4.1 61.05,22.05 59.84,23.26 arc-45 59.55,23.96 59.55,32.89 arc45 59.26,33.59 56.04,36.81 arc-45 55.75,37.51 55.75,39.55 PCB1.BOUTR'
N$23
  Top 0.254: R28.2 93.79,25.79 arc-45 93.09,25.5 65.95,25.5 arc-90 64.95,26.5 64.95,28.05 DA4.5
N$25
  Top 0.254: R28.2' 89.74,24.26 arc45 89.04,24.55 64.65,24.55 arc90 63.65,23.55 63.65,21.95 DA4.3
N$29
  Top 0.254: C1.+ 32.6,30.52 arc45 33.31,30.81 35.21,32.71 arc-45 35.91,33 37.75,33 arc90 38.75,34 38.75,37.25 arc90 37.75,38.25 37.1,38.25 L1.2 36.9,38.25 35.66,38.25 arc-45 34.96,38.54 34.79,38.71 arc45 34.09,39 DA1.3
N$31
  Top 0.254: DD1.18 16.48,16.25 arc45 R5.1 16,16 arc-90 15,15 12.35,15 arc-90 11.35,16 ZQ1.3 9.03,16.07 C6.2
N$36
  Top 0.254: C30.+ 50.75,21.3 49.84,22.21 arc45 49.14,22.5 45.75,22.5 C29.1 45.7,22.65 45.7,23.44 arc45 45.41,24.14 42.69,26.86 arc45 41.99,27.15 37.26,27.15 arc45 36.56,26.86 36.39,26.69 arc45 36.1,25.99 36.1,24.31 arc45 36.39,23.61 36.9,23.1 C23.2 37,23 39.16,20.84 arc-45 39.45,20.14 39.45,16.26 arc-45 39.16,15.56 38.45,14.85 R20.2
N$39
  Top 0.254: R1.2 53.75,13.95 54.31,13.39 arc-45 54.6,12.69 54.6,11.39 arc-45 54.33,10.72 | 54.33,10.72 54.29,10.69 arc-45 53.59,10.4 52.21,10.4 arc45 51.51,10.11 50.65,9.25 PCB1.ARFBK | 54.33,10.72 54.4,10.65 54.4,9.36 arc45 54.69,8.66 55.41,7.94 arc-45 55.7,7.24 55.7,5.45 PCB1.BINR
N$40
  Top 0.254: R2.2 51.1,13.95 52.06,14.91 arc-45 52.76,15.2 54.24,15.2 arc-45 54.94,14.91 56.36,13.49 arc-45 56.65,12.79 56.65,5.41 arc-45 56.36,4.71 55.44,3.79 arc-45 54.74,3.5 PCB1.BINL 54.35,3.55 53.86,3.55 arc-45 53.16,3.84 52.1,4.9 arc-45 51.95,5.26 51.95,5.49 arc45 51.8,5.85 50.64,7.01 arc45 49.94,7.3 49.4,7.3 PCB1.ALFBK
N$41
  Bottom 0.254: PCB1.ACV1 PCB1.ACV1'
N$42
  Bottom 0.254: PCB1.ACV2' PCB1.ACV2
N$44  (via drill 0.33)
  Top 0.254: v27.75,21.75 27.54,21.54 arc-45 26.84,21.25 26.75,21.25 arc90 25.75,20.25 DD1.3
  Bottom 0.254: A1.8 30.12,24.53 arc-45 29.83,23.83 v27.75,21.75
N$45
  Top 0.254: DD1.12 21.25,20.25 arc90 20.25,21.25 19.41,21.25 arc-45 18.71,21.54 18.04,22.21 arc-45 17.75,22.91 17.75,30.59 arc-45 18.04,31.29 18.46,31.71 arc-45 19.16,32 23.04,32 arc-45 23.74,31.71 R13.2
N$46
  Top 0.254: DD1.11 21.75,20.59 arc45 21.46,21.29 21.29,21.46 arc45 20.59,21.75 19.66,21.75 arc-45 18.96,22.04 18.54,22.46 arc-45 18.25,23.16 18.25,30.34 arc-45 18.54,31.04 18.71,31.21 arc-45 19.41,31.5 21.04,31.5 arc-45 21.74,31.21 R12.2
N$47
  Top 0.254: DD1.25 21.25,10.41 arc-45 20.96,9.71 19.04,7.79 arc-45 18.34,7.5 R11.2
N$48
  Top 0.254: DD1.26 21.75,8.2 R16.2 21.45,8 20.91,8 arc45 20.21,7.71 18.54,6.04 arc-45 17.84,5.75 12.91,5.75 arc-45 12.21,6.04 7.29,10.96 arc-45 7,11.66 7,34 arc-90 8,35 18.96,35 arc-90 19.96,34 A1.4
N$49
  Top 0.254: DD1.36 26.75,11.16 arc45 27.04,10.46 27.21,10.29 arc45 27.91,10 30.14,10 arc-45 30.84,9.71 R10.2
N$50
  Top 0.254: DD1.10 22.25,20.84 arc45 21.96,21.54 21.54,21.96 arc45 20.84,22.25 19.91,22.25 arc-45 19.21,22.54 19.04,22.71 arc-45 18.75,23.41 18.75,29.5 arc-90 19.75,30.5 19.95,30.5 R9.2
N$51
  Top 0.254: DD1.9 22.75,20.99 arc45 22.46,21.69 20.1,24.05 R8.2
N$52
  Top 0.254: DD1.34 25.75,11.16 arc45 26.04,10.46 26.71,9.79 arc45 27.41,9.5 28,9.5 arc-90 29,8.5 R7.2
N$53
  Top 0.254: DD1.33 25.25,10.91 arc45 25.54,10.21 26.21,9.54 arc-45 26.5,8.84 R6.2
N$54
  Top 0.254: DD1.44 29.34,16.75 arc45 30.04,17.04 30.21,17.21 arc45 30.5,17.91 30.5,18.59 arc-45 30.79,19.29 arc-45 31.29,19.5 C13.2
N$55
  Top 0.254: A1.11 30.12,42.25 arc90 29.12,43.25 27.25,43.25 arc-90 26.25,44.25 R14.1
N$56
  Top 0.254: R15.1 38.45,18.14 arc45 38.16,18.84 37,20 C15.2
N$57
  Top 0.254: R14.2 13.56,44.9 arc45 12.86,44.61 11.04,42.79 arc45 10.75,42.09 10.75,40.5 arc-90 9.75,39.5 9.04,39.5 HL1.A2
N$58
  Top 0.254: R15.2 35.09,15.54 arc-45 34.39,15.25 30.54,15.25 arc-45 30.04,15.46 arc45 29.34,15.75 DD1.42
N$59
  Top 0.254: DD1.39 36.3,14.25 R20.1 R17.2
N$60
  Top 0.254: R17.1 38.45,12.35 39.16,13.06 arc45 39.45,13.76 39.45,14.79 arc-45 39.74,15.49 arc45 39.95,15.99 39.95,22.64 arc45 39.66,23.34 37,26 C17.2
N$61
  Top 0.254: DD1.46 28.5,17.75 arc90 29.5,18.75 29.5,21.54 arc-45 29.79,22.24 R18.2 R19.1
N$62
  Top 0.254: R18.1 33.95,25.1 36.66,27.81 arc45 36.95,28.51 C20.2
N$65
  Top 0.254: R21.1 28.35,45.65 28.04,45.96 arc45 27.34,46.25 11.12,46.25 arc45 10.42,45.96 HL1.A1
N$66
  Top 0.254: A1.10 32.66,44 arc90 31.66,45 30.35,45 R21.2
RMIX
  Top 0.254: R1.1 53.15,12.05 52.29,11.19 arc-45 51.59,10.9 50.16,10.9 arc45 49.46,10.61 48.1,9.25 PCB1.ARMIX
  Bottom 0.254: PCB1.ARMIX' PCB1.ARMIX
SMBCLK
  Bottom 0.254: PCB1.ASMBCLK PCB1.ASMBCLK' 56.71,36.78 arc45 57,37.48 57,46.09 arc45 56.71,46.79 55.04,48.46 arc45 54.34,48.75 29.16,48.75 arc45 28.46,48.46 24.04,44.04 arc45 23.75,43.34 23.75,36.66 arc-45 23.46,35.96 22.79,35.29 arc45 22.5,34.59 A1.5
SMBDAT
  Bottom 0.254: PCB1.ASMBDAT PCB1.ASMBDAT' 54.45,39.39 arc45 54.15,40.1 53.54,40.71 arc-45 53.25,41.41 53.25,46.09 arc45 52.96,46.79 52.04,47.71 arc45 51.34,48 29.66,48 arc45 28.96,47.71 26.54,45.29 arc45 26.25,44.59 26.25,36.91 arc-45 25.96,36.21 25.33,35.58 arc45 25.04,34.88 A1.6
USB_N
  Top 0.152: XS1.D- 11.13,25.8 arc45 11.84,26.09 12.03,26.28 arc45 12.32,26.99 12.32,33.67 A1.1
USB_P
  Top 0.152: XS1.D+ 10.84,25 arc45 11.54,25.29 12.38,26.13 arc45 12.68,26.84 12.68,31.07 arc-45 12.97,31.78 A1.2